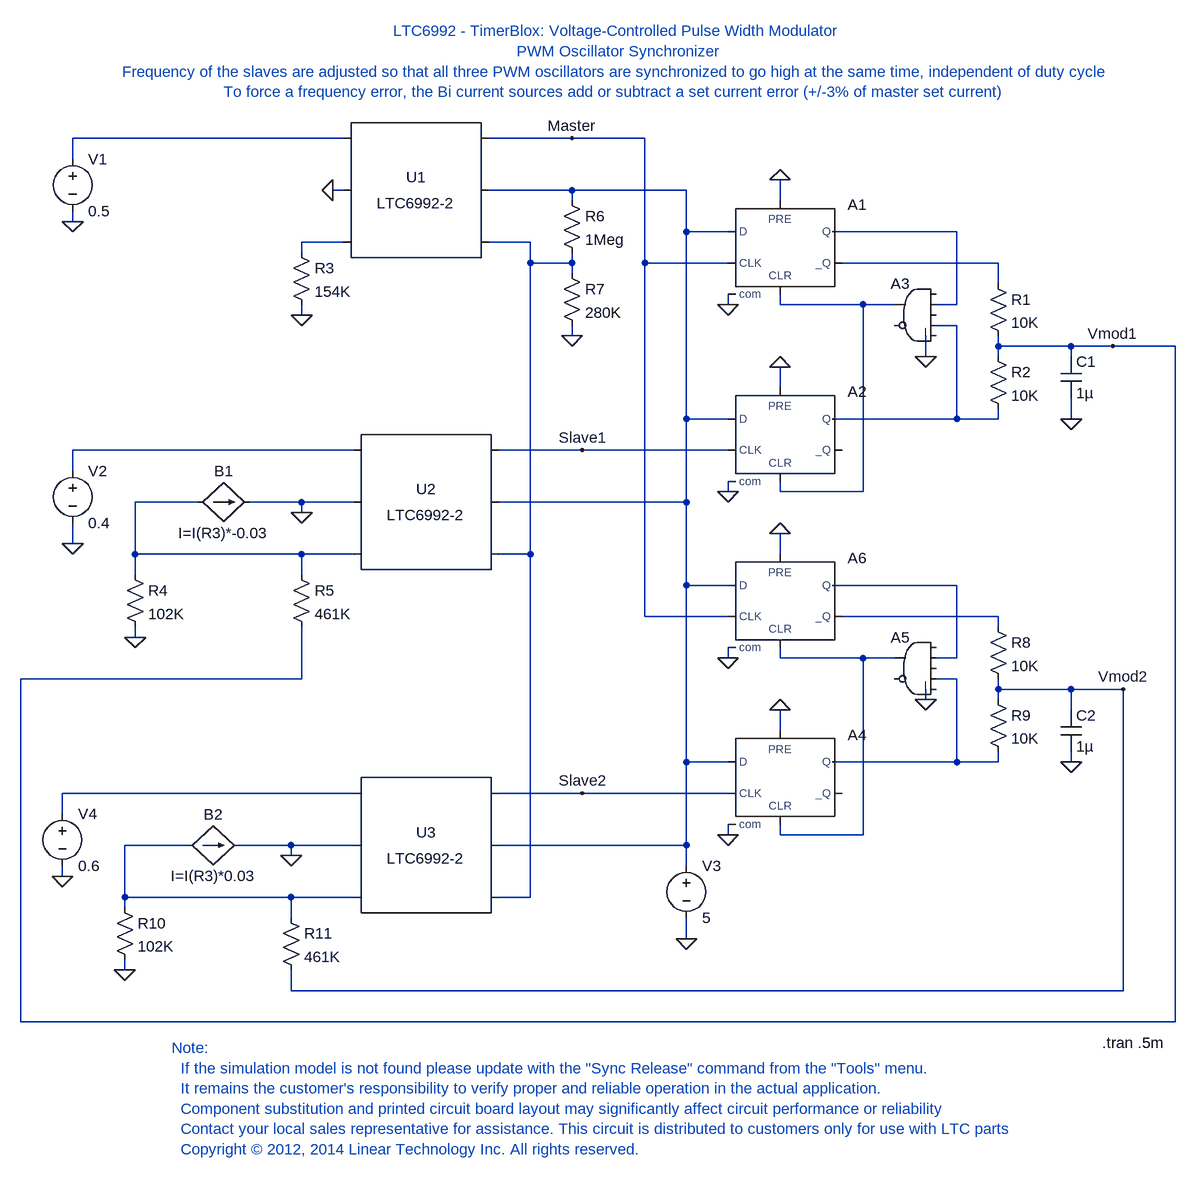
[diagram p0: schematic LTC6992-2.asc]
LTC6992-2.asc, the LTspice schematic file:
Version 4
SHEET 1 2456 1316
WIRE -848 -240 -1264 -240
WIRE -496 -240 -624 -240
WIRE -384 -240 -496 -240
WIRE -1264 -208 -1264 -240
WIRE -848 -160 -864 -160
WIRE -496 -160 -624 -160
WIRE -320 -160 -496 -160
WIRE -496 -144 -496 -160
WIRE -176 -144 -176 -176
WIRE -1264 -112 -1264 -128
WIRE -320 -96 -320 -160
WIRE -256 -96 -320 -96
WIRE 96 -96 -96 -96
WIRE -848 -80 -912 -80
WIRE -560 -80 -624 -80
WIRE -912 -64 -912 -80
WIRE -560 -48 -560 -80
WIRE -496 -48 -496 -64
WIRE -496 -48 -560 -48
WIRE -384 -48 -384 -240
WIRE -256 -48 -384 -48
WIRE 160 -48 -80 -48
WIRE -496 -32 -496 -48
WIRE 160 -16 160 -48
WIRE -256 16 -256 0
WIRE -176 16 -176 0
WIRE -48 16 -176 16
WIRE 0 16 -48 16
WIRE 96 16 96 -96
WIRE 96 16 64 16
WIRE -912 32 -912 16
WIRE 96 48 64 48
WIRE -496 64 -496 48
WIRE 160 80 160 64
WIRE 272 80 160 80
WIRE 336 80 272 80
WIRE 432 80 336 80
WIRE 48 96 48 64
WIRE 160 96 160 80
WIRE 272 96 272 80
WIRE -176 144 -176 112
WIRE -320 192 -320 -96
WIRE -256 192 -320 192
WIRE 96 192 96 48
WIRE 96 192 -96 192
WIRE 160 192 160 176
WIRE 160 192 96 192
WIRE 272 192 272 160
WIRE -832 240 -1264 240
WIRE -480 240 -608 240
WIRE -256 240 -480 240
WIRE -1264 272 -1264 240
WIRE -256 304 -256 288
WIRE -176 304 -176 288
WIRE -48 304 -48 16
WIRE -48 304 -176 304
WIRE -1072 320 -1168 320
WIRE -912 320 -992 320
WIRE -832 320 -912 320
WIRE -320 320 -320 192
WIRE -320 320 -608 320
WIRE -912 336 -912 320
WIRE -1264 384 -1264 352
WIRE -1168 400 -1168 320
WIRE -912 400 -1168 400
WIRE -832 400 -912 400
WIRE -560 400 -560 -48
WIRE -560 400 -608 400
WIRE -176 400 -176 368
WIRE -1168 432 -1168 400
WIRE -912 432 -912 400
WIRE -320 448 -320 320
WIRE -256 448 -320 448
WIRE 96 448 -96 448
WIRE -384 496 -384 -48
WIRE -256 496 -384 496
WIRE 160 496 -80 496
WIRE 160 512 160 496
WIRE -1168 528 -1168 512
WIRE -256 560 -256 544
WIRE -176 560 -176 544
WIRE -48 560 -176 560
WIRE 0 560 -48 560
WIRE 96 560 96 448
WIRE 96 560 64 560
WIRE -912 592 -912 512
WIRE -912 592 -1344 592
WIRE 96 592 64 592
WIRE 160 608 160 592
WIRE 272 608 160 608
WIRE 352 608 272 608
WIRE 48 624 48 608
WIRE 160 624 160 608
WIRE 272 640 272 608
WIRE -176 672 -176 640
WIRE -320 720 -320 448
WIRE -256 720 -320 720
WIRE 96 720 96 592
WIRE 96 720 -96 720
WIRE 160 720 160 704
WIRE 160 720 96 720
WIRE 272 720 272 704
WIRE -832 768 -1280 768
WIRE -480 768 -608 768
WIRE -256 768 -480 768
WIRE -1280 800 -1280 768
WIRE -256 832 -256 816
WIRE -176 832 -176 816
WIRE -48 832 -48 560
WIRE -48 832 -176 832
WIRE -1088 848 -1184 848
WIRE -928 848 -1008 848
WIRE -832 848 -928 848
WIRE -320 848 -320 720
WIRE -320 848 -608 848
WIRE -928 864 -928 848
WIRE -320 880 -320 848
WIRE -1280 896 -1280 880
WIRE -1184 928 -1184 848
WIRE -928 928 -1184 928
WIRE -832 928 -928 928
WIRE -560 928 -560 400
WIRE -560 928 -608 928
WIRE -1184 944 -1184 928
WIRE -928 960 -928 928
WIRE -320 992 -320 960
WIRE -1184 1040 -1184 1024
WIRE -928 1072 -928 1040
WIRE 352 1072 352 608
WIRE 352 1072 -928 1072
WIRE -1344 1120 -1344 592
WIRE 432 1120 432 80
WIRE 432 1120 -1344 1120
FLAG 272 192 0
FLAG -320 992 0
FLAG -256 16 0
FLAG 48 96 0
FLAG -256 304 0
FLAG -176 -176 0
FLAG -176 112 0
FLAG -912 32 0
FLAG -1168 528 0
FLAG -864 -160 0
FLAG -912 336 0
FLAG -496 64 0
FLAG -1264 -112 0
FLAG -1264 384 0
FLAG 272 720 0
FLAG 48 624 0
FLAG -256 832 0
FLAG -176 640 0
FLAG -1184 1040 0
FLAG -928 864 0
FLAG -1280 896 0
FLAG -496 -240 Master
FLAG -480 240 Slave1
FLAG -480 768 Slave2
FLAG -256 560 0
FLAG -176 368 0
FLAG 336 80 Vmod1
FLAG 352 608 Vmod2
SYMBOL dflop -176 -144 R0
WINDOW 3 8 8 Invisible 2
SYMATTR Value trise=10n tfall=10n Vhigh=5
SYMATTR InstName A1
SYMBOL dflop -176 144 R0
WINDOW 3 8 8 Invisible 2
SYMATTR Value trise=10n tfall=10n Vhigh=5
SYMATTR InstName A2
SYMBOL and 32 -32 M0
WINDOW 3 16 48 Invisible 2
SYMATTR Value trise=10n tfall=10n Vhigh=5
SYMATTR InstName A3
SYMBOL res 144 -32 R0
SYMATTR InstName R1
SYMATTR Value 10K
SYMBOL res 144 80 R0
SYMATTR InstName R2
SYMATTR Value 10K
SYMBOL cap 256 96 R0
SYMATTR InstName C1
SYMATTR Value 1µ
SYMBOL voltage -320 864 R0
WINDOW 123 24 138 Left 2
WINDOW 39 24 117 Left 2
SYMATTR InstName V3
SYMATTR Value 5
SYMBOL LTC6992-2 -736 -160 R0
SYMATTR InstName U1
SYMBOL LTC6992-2 -720 320 R0
SYMATTR InstName U2
SYMBOL res -928 -80 R0
SYMATTR InstName R3
SYMATTR Value 154K
SYMBOL res -1184 416 R0
SYMATTR InstName R4
SYMATTR Value 102K
SYMBOL res -928 416 R0
SYMATTR InstName R5
SYMATTR Value 461K
SYMBOL voltage -1264 -224 R0
WINDOW 123 0 0 Left 2
WINDOW 39 0 0 Left 2
SYMATTR InstName V1
SYMATTR Value 0.5
SYMBOL voltage -1264 256 R0
WINDOW 123 0 0 Left 2
WINDOW 39 0 0 Left 2
SYMATTR InstName V2
SYMATTR Value 0.4
SYMBOL res -512 -160 R0
SYMATTR InstName R6
SYMATTR Value 1Meg
SYMBOL res -512 -48 R0
SYMATTR InstName R7
SYMATTR Value 280K
SYMBOL dflop -176 672 R0
WINDOW 3 8 8 Invisible 2
SYMATTR Value trise=10n tfall=10n Vhigh=5
SYMATTR InstName A4
SYMBOL and 32 512 M0
WINDOW 3 16 48 Invisible 2
SYMATTR Value trise=10n tfall=10n Vhigh=5
SYMATTR InstName A5
SYMBOL res 144 496 R0
SYMATTR InstName R8
SYMATTR Value 10K
SYMBOL res 144 608 R0
SYMATTR InstName R9
SYMATTR Value 10K
SYMBOL cap 256 640 R0
SYMATTR InstName C2
SYMATTR Value 1µ
SYMBOL LTC6992-2 -720 848 R0
SYMATTR InstName U3
SYMBOL res -1200 928 R0
SYMATTR InstName R10
SYMATTR Value 102K
SYMBOL res -944 944 R0
SYMATTR InstName R11
SYMATTR Value 461K
SYMBOL voltage -1280 784 R0
WINDOW 123 0 0 Left 2
WINDOW 39 0 0 Left 2
SYMATTR InstName V4
SYMATTR Value 0.6
SYMBOL dflop -176 400 R0
WINDOW 3 8 8 Invisible 2
SYMATTR Value trise=10n tfall=10n Vhigh=5
SYMATTR InstName A6
SYMBOL bi -1072 320 R270
WINDOW 0 32 40 VTop 2
WINDOW 3 -32 40 VBottom 2
SYMATTR InstName B1
SYMATTR Value I=I(R3)*-0.03
SYMBOL bi -1088 848 R270
WINDOW 0 32 40 VTop 2
WINDOW 3 -32 40 VBottom 2
SYMATTR InstName B2
SYMATTR Value I=I(R3)*0.03
TEXT 320 1152 Left 2 !.tran .5m
TEXT -1112 1160 Left 2 ;Note:\n  If the simulation model is not found please update with the "Sync Release" command from the "Tools" menu.\n  It remains the customer's responsibility to verify proper and reliable operation in the actual application.\n  Component substitution and printed circuit board layout may significantly affect circuit performance or reliability\n  Contact your local sales representative for assistance. This circuit is distributed to customers only for use with LTC parts\n  Copyright © 2012, 2014 Linear Technology Inc. All rights reserved.
TEXT -424 -296 Bottom 2 ;LTC6992 - TimerBlox: Voltage-Controlled Pulse Width Modulator\nPWM Oscillator Synchronizer\nFrequency of the slaves are adjusted so that all three PWM oscillators are synchronized to go high at the same time, independent of duty cycle\nTo force a frequency error, the Bi current sources add or subtract a set current error (+/-3% of master set current)

The netlist it stands for:
* LTC6992-2.asc
A1 N002 0 Master 0 N007 N006 N003 0 DFLOP trise=10n tfall=10n Vhigh=5
A2 N002 0 Slave1 0 N007 0 N008 0 DFLOP trise=10n tfall=10n Vhigh=5
A3 0 N003 0 N008 0 0 N007 0 AND trise=10n tfall=10n Vhigh=5
R1 N006 Vmod1 10K
R2 Vmod1 N008 10K
C1 Vmod1 0 1µ
V3 N002 0 5
XU1 N001 0 N004 N005 N002 Master LTC6992-2
XU2 N009 0 N010 N005 N002 Slave1 LTC6992-2
R3 N004 0 154K
R4 N010 0 102K
R5 N010 Vmod1 461K
V1 N001 0 0.5
V2 N009 0 0.4
R6 N002 N005 1Meg
R7 N005 0 280K
A4 N002 0 Slave2 0 N013 0 N014 0 DFLOP trise=10n tfall=10n Vhigh=5
A5 0 N011 0 N014 0 0 N013 0 AND trise=10n tfall=10n Vhigh=5
R8 N012 Vmod2 10K
R9 Vmod2 N014 10K
C2 Vmod2 0 1µ
XU3 N015 0 N016 N005 N002 Slave2 LTC6992-2
R10 N016 0 102K
R11 N016 Vmod2 461K
V4 N015 0 0.6
A6 N002 0 Master 0 N013 N012 N011 0 DFLOP trise=10n tfall=10n Vhigh=5
B1 N010 0 I=I(R3)*-0.03
B2 N016 0 I=I(R3)*0.03
.tran .5m
* Note:
*   If the simulation model is not found please update with the "Sync Release" command from the "Tools" menu.
*   It remains the customer's responsibility to verify proper and reliable operation in the actual application.
*   Component substitution and printed circuit board layout may significantly affect circuit performance or reliability
*   Contact your local sales representative for assistance. This circuit is distributed to customers only for use with LTC parts
*   Copyright © 2012, 2014 Linear Technology Inc. All rights reserved.
* LTC6992 - TimerBlox: Voltage-Controlled Pulse Width Modulator
* PWM Oscillator Synchronizer
* Frequency of the slaves are adjusted so that all three PWM oscillators are synchronized to go high at the same time, independent of duty cycle
* To force a frequency error, the Bi current sources add or subtract a set current error (+/-3% of master set current)
.lib LTC6992-2.sub
.backanno
.end